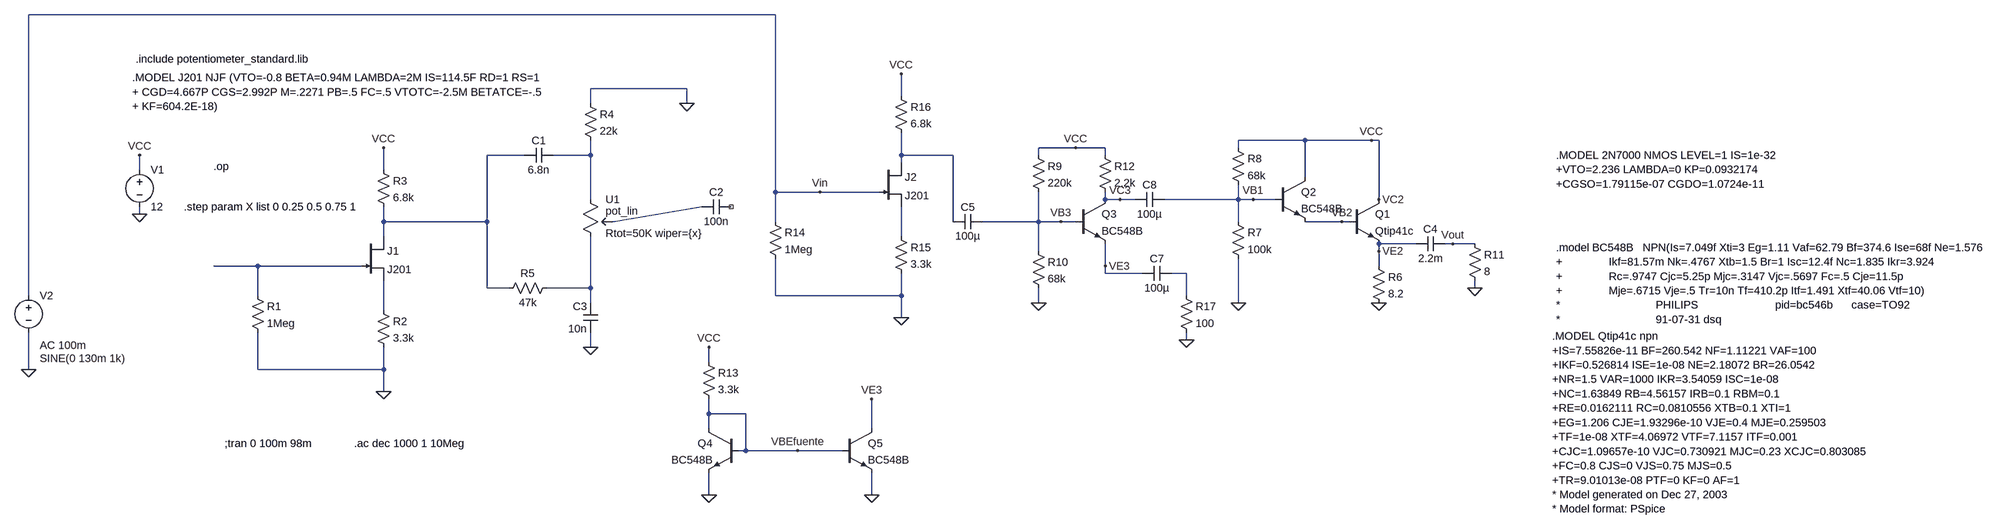
[diagram p0: schematic CircuitoCompletoNuevo.asc]
CircuitoCompletoNuevo.asc, the LTspice schematic file:
Version 4
SHEET 1 5808 1124
WIRE 624 -80 -992 -80
WIRE 432 80 224 80
WIRE 896 96 896 48
WIRE 224 112 224 80
WIRE 432 112 432 80
WIRE 1856 192 1712 192
WIRE 2000 192 1856 192
WIRE 2016 192 2000 192
WIRE 1360 208 1280 208
WIRE 1424 208 1360 208
WIRE 1712 208 1712 192
WIRE 80 224 0 224
WIRE 224 224 224 192
WIRE 224 224 144 224
WIRE 896 224 896 176
WIRE 1008 224 896 224
WIRE 1280 224 1280 208
WIRE 1424 224 1424 208
WIRE 896 240 896 224
WIRE -752 256 -752 224
WIRE -224 256 -224 208
WIRE 1856 272 1856 192
WIRE 624 304 624 -80
WIRE 720 304 624 304
WIRE 848 304 720 304
WIRE 224 320 224 224
WIRE 1424 320 1424 304
WIRE 1456 320 1424 320
WIRE 1488 320 1456 320
WIRE 1712 320 1712 288
WIRE 1712 320 1552 320
WIRE 1744 320 1712 320
WIRE 1792 320 1744 320
WIRE 2016 320 2016 192
WIRE -752 352 -752 336
WIRE -224 368 -224 336
WIRE 0 368 0 224
WIRE 0 368 -224 368
WIRE 272 368 464 336
WIRE 624 368 624 304
WIRE 1008 368 1008 224
WIRE 1280 368 1280 304
WIRE 1280 368 1072 368
WIRE 1328 368 1280 368
WIRE 1360 368 1328 368
WIRE 1712 368 1712 320
WIRE 1936 368 1856 368
WIRE 1952 368 1936 368
WIRE -224 400 -224 368
WIRE 896 400 896 336
WIRE 2096 416 2016 416
WIRE 2176 416 2160 416
WIRE 2224 416 2176 416
WIRE 1280 432 1280 368
WIRE 2016 432 2016 416
WIRE -496 464 -592 464
WIRE -272 464 -496 464
WIRE 1424 464 1424 416
WIRE 2016 464 2016 432
WIRE 1424 480 1424 464
WIRE 1504 480 1424 480
WIRE 1600 480 1568 480
WIRE 0 512 0 368
WIRE 48 512 0 512
WIRE 224 512 224 400
WIRE 224 512 128 512
WIRE 2224 512 2224 496
WIRE -992 528 -992 -80
WIRE -496 528 -496 464
WIRE 624 528 624 448
WIRE 896 528 896 480
WIRE 896 528 624 528
WIRE 1600 528 1600 480
WIRE 224 544 224 512
WIRE 1280 544 1280 512
WIRE 1712 544 1712 448
WIRE -224 560 -224 496
WIRE 896 576 896 528
WIRE 1600 624 1600 608
WIRE 224 640 224 608
WIRE 480 672 480 640
WIRE -992 688 -992 608
WIRE -496 688 -496 608
WIRE -224 688 -224 640
WIRE -224 688 -496 688
WIRE -224 736 -224 688
WIRE 480 784 480 752
WIRE 560 784 480 784
WIRE 480 816 480 784
WIRE 832 816 832 752
WIRE 560 864 560 784
WIRE 560 864 544 864
WIRE 672 864 560 864
WIRE 768 864 672 864
WIRE 480 960 480 912
WIRE 832 960 832 912
FLAG -224 736 0
FLAG -752 352 0
FLAG -752 224 VCC
FLAG -224 208 VCC
FLAG 720 304 Vin
FLAG 224 640 0
FLAG 2000 192 VCC
FLAG 2016 544 0
FLAG 1712 544 0
FLAG 1936 368 VB2
FLAG 1744 320 VB1
FLAG 2016 432 VE2
FLAG 1280 544 0
FLAG 1360 208 VCC
FLAG 1328 368 VB3
FLAG 2224 512 0
FLAG 2016 320 VC2
FLAG 1456 320 VC3
FLAG 1424 464 VE3
FLAG 480 960 0
FLAG 480 640 VCC
FLAG 832 960 0
FLAG 832 752 VE3
FLAG 1600 624 0
FLAG 672 864 VBEfuente
FLAG 2176 416 Vout
FLAG 432 112 0
FLAG 896 576 0
FLAG 896 48 VCC
FLAG -992 688 0
SYMBOL njf -272 400 R0
SYMATTR InstName J1
SYMATTR Value J201
SYMBOL res -512 512 R0
SYMATTR InstName R1
SYMATTR Value 1Meg
SYMBOL res -240 544 R0
SYMATTR InstName R2
SYMATTR Value 3.3k
SYMBOL res -240 240 R0
SYMATTR InstName R3
SYMATTR Value 6.8k
SYMBOL voltage -752 240 R0
SYMATTR InstName V1
SYMATTR Value 12
SYMBOL voltage -992 512 R0
WINDOW 3 24 152 Left 2
WINDOW 123 24 124 Left 2
WINDOW 39 0 0 Left 2
SYMATTR Value SINE(0 130m 1k)
SYMATTR Value2 AC 100m
SYMATTR InstName V2
SYMBOL cap 144 208 R90
WINDOW 0 0 32 VBottom 2
WINDOW 3 32 32 VTop 2
SYMATTR InstName C1
SYMATTR Value 6.8n
SYMBOL cap 240 608 R180
WINDOW 0 24 56 Left 2
WINDOW 3 24 8 Left 2
SYMATTR InstName C3
SYMATTR Value 10n
SYMBOL res 208 96 R0
SYMATTR InstName R4
SYMATTR Value 22k
SYMBOL res 144 496 R90
WINDOW 0 0 56 VBottom 2
WINDOW 3 32 56 VTop 2
SYMATTR InstName R5
SYMATTR Value 47k
SYMBOL potentiometer_standard 208 304 R0
SYMATTR InstName U1
SYMATTR Value Rtot=50K wiper={x}
SYMATTR SpiceLine ""
SYMBOL npn 1952 320 R0
SYMATTR InstName Q1
SYMATTR Value Qtip41c
SYMBOL npn 1792 272 R0
SYMATTR InstName Q2
SYMATTR Value BC548B
SYMBOL res 2000 448 R0
SYMATTR InstName R6
SYMATTR Value 8.2
SYMBOL res 1696 352 R0
SYMATTR InstName R7
SYMATTR Value 100k
SYMBOL res 1696 192 R0
SYMATTR InstName R8
SYMATTR Value 68k
SYMBOL npn 1360 320 R0
SYMATTR InstName Q3
SYMATTR Value BC548B
SYMBOL res 1264 208 R0
SYMATTR InstName R9
SYMATTR Value 220k
SYMBOL res 1264 416 R0
SYMATTR InstName R10
SYMATTR Value 68k
SYMBOL res 2208 400 R0
SYMATTR InstName R11
SYMATTR Value 8
SYMBOL cap 2096 432 R270
WINDOW 0 32 32 VTop 2
WINDOW 3 0 32 VBottom 2
SYMATTR InstName C4
SYMATTR Value 2.2m
SYMBOL res 1408 208 R0
SYMATTR InstName R12
SYMATTR Value 2.2k
SYMBOL npn 544 816 M0
SYMATTR InstName Q4
SYMATTR Value BC548B
SYMBOL res 464 656 R0
SYMATTR InstName R13
SYMATTR Value 3.3k
SYMBOL npn 768 816 R0
SYMATTR InstName Q5
SYMATTR Value BC548B
SYMBOL cap 1504 496 R270
WINDOW 0 32 32 VTop 2
WINDOW 3 0 32 VBottom 2
SYMATTR InstName C7
SYMATTR Value 100µ
SYMBOL res 1584 512 R0
SYMATTR InstName R17
SYMATTR Value 100
SYMBOL cap 1552 304 R90
WINDOW 0 0 32 VBottom 2
WINDOW 3 32 32 VTop 2
SYMATTR InstName C8
SYMATTR Value 100µ
SYMBOL njf 848 240 R0
SYMATTR InstName J2
SYMATTR Value J201
SYMBOL res 608 352 R0
SYMATTR InstName R14
SYMATTR Value 1Meg
SYMBOL res 880 384 R0
SYMATTR InstName R15
SYMATTR Value 3.3k
SYMBOL res 880 80 R0
SYMATTR InstName R16
SYMATTR Value 6.8k
SYMBOL cap 528 320 R90
WINDOW 0 0 32 VBottom 2
WINDOW 3 32 32 VTop 2
SYMATTR InstName C2
SYMATTR Value 100n
SYMBOL cap 1072 352 R90
WINDOW 0 0 32 VBottom 2
WINDOW 3 32 32 VTop 2
SYMATTR InstName C5
SYMATTR Value 100µ
TEXT -768 56 Left 2 !.MODEL J201 NJF (VTO=-0.8 BETA=0.94M LAMBDA=2M IS=114.5F RD=1 RS=1\n+ CGD=4.667P CGS=2.992P M=.2271 PB=.5 FC=.5 VTOTC=-2.5M BETATCE=-.5\n+ KF=604.2E-18)
TEXT -592 248 Left 2 !.op
TEXT -760 16 Left 2 !.include potentiometer_standard.lib
TEXT -656 336 Left 2 !.step param X list 0 0.25 0.5 0.75 1
TEXT 3328 616 Left 2 !.MODEL Qtip41c npn\n+IS=7.55826e-11 BF=260.542 NF=1.11221 VAF=100\n+IKF=0.526814 ISE=1e-08 NE=2.18072 BR=26.0542\n+NR=1.5 VAR=1000 IKR=3.54059 ISC=1e-08\n+NC=1.63849 RB=4.56157 IRB=0.1 RBM=0.1\n+RE=0.0162111 RC=0.0810556 XTB=0.1 XTI=1\n+EG=1.206 CJE=1.93296e-10 VJE=0.4 MJE=0.259503\n+TF=1e-08 XTF=4.06972 VTF=7.1157 ITF=0.001\n+CJC=1.09657e-10 VJC=0.730921 MJC=0.23 XCJC=0.803085\n+FC=0.8 CJS=0 VJS=0.75 MJS=0.5\n+TR=9.01013e-08 PTF=0 KF=0 AF=1\n* Model generated on Dec 27, 2003\n* Model format: PSpice
TEXT 3336 424 Left 2 !.model BC548B   NPN(Is=7.049f Xti=3 Eg=1.11 Vaf=62.79 Bf=374.6 Ise=68f Ne=1.576\n+               Ikf=81.57m Nk=.4767 Xtb=1.5 Br=1 Isc=12.4f Nc=1.835 Ikr=3.924\n+               Rc=.9747 Cjc=5.25p Mjc=.3147 Vjc=.5697 Fc=.5 Cje=11.5p\n+               Mje=.6715 Vje=.5 Tr=10n Tf=410.2p Itf=1.491 Xtf=40.06 Vtf=10)\n*                               PHILIPS                         pid=bc546b      case=TO92\n*                               91-07-31 dsq
TEXT 3336 224 Left 2 !.MODEL 2N7000 NMOS LEVEL=1 IS=1e-32\n+VTO=2.236 LAMBDA=0 KP=0.0932174\n+CGSO=1.79115e-07 CGDO=1.0724e-11
TEXT -568 848 Left 2 !;tran 0 100m 98m
TEXT -288 848 Left 2 !.ac dec 1000 1 10Meg

The netlist it stands for:
* CircuitoCompletoNuevo.asc
J1 N001 N006 N009 J201
R1 N006 0 1Meg
R2 N009 0 3.3k
R3 VC2 N001 6.8k
V1 VC2 0 12
V2 Vin 0 SINE(0 130m 1k) AC 100m
C1 N002 N001 6.8n
C3 0 N008 10n
R4 0 N002 22k
R5 N008 N001 47k
XU1 N002 N008 N004 pot_lin Rtot=50K wiper={x}  ; pins A B C
Q1 VC2 VB2 VE2 0 Qtip41c
Q2 VC2 VB1 VB2 0 BC548B
R6 VE2 0 8.2
R7 VB1 0 100k
R8 VC2 VB1 68k
Q3 VC3 VB3 VE3 0 BC548B
R9 VC2 VB3 220k
R10 VB3 0 68k
R11 Vout 0 8
C4 VE2 Vout 2.2m
R12 VC2 VC3 2.2k
Q4 VBEfuente VBEfuente 0 0 BC548B
R13 VC2 VBEfuente 3.3k
Q5 VE3 VBEfuente 0 0 BC548B
C7 VE3 N007 100µ
R17 N007 0 100
C8 VB1 VC3 100µ
J2 N003 Vin N005 J201
R14 Vin 0 1Meg
R15 N005 0 3.3k
R16 VC2 N003 6.8k
C2 NC_01 N004 100n
C5 VB3 N003 100µ
.model NPN NPN
.model PNP PNP
.lib standard.bjt
.model NJF NJF
.model PJF PJF
.lib standard.jft
.MODEL J201 NJF (VTO=-0.8 BETA=0.94M LAMBDA=2M IS=114.5F RD=1 RS=1
+ CGD=4.667P CGS=2.992P M=.2271 PB=.5 FC=.5 VTOTC=-2.5M BETATCE=-.5
+ KF=604.2E-18)
.op
.include potentiometer_standard.lib
.step param X list 0 0.25 0.5 0.75 1
.MODEL Qtip41c npn
+IS=7.55826e-11 BF=260.542 NF=1.11221 VAF=100
+IKF=0.526814 ISE=1e-08 NE=2.18072 BR=26.0542
+NR=1.5 VAR=1000 IKR=3.54059 ISC=1e-08
+NC=1.63849 RB=4.56157 IRB=0.1 RBM=0.1
+RE=0.0162111 RC=0.0810556 XTB=0.1 XTI=1
+EG=1.206 CJE=1.93296e-10 VJE=0.4 MJE=0.259503
+TF=1e-08 XTF=4.06972 VTF=7.1157 ITF=0.001
+CJC=1.09657e-10 VJC=0.730921 MJC=0.23 XCJC=0.803085
+FC=0.8 CJS=0 VJS=0.75 MJS=0.5
+TR=9.01013e-08 PTF=0 KF=0 AF=1
* Model generated on Dec 27, 2003
* Model format: PSpice
.model BC548B   NPN(Is=7.049f Xti=3 Eg=1.11 Vaf=62.79 Bf=374.6 Ise=68f Ne=1.576
+               Ikf=81.57m Nk=.4767 Xtb=1.5 Br=1 Isc=12.4f Nc=1.835 Ikr=3.924
+               Rc=.9747 Cjc=5.25p Mjc=.3147 Vjc=.5697 Fc=.5 Cje=11.5p
+               Mje=.6715 Vje=.5 Tr=10n Tf=410.2p Itf=1.491 Xtf=40.06 Vtf=10)
*                               PHILIPS                         pid=bc546b      case=TO92
*                               91-07-31 dsq
.MODEL 2N7000 NMOS LEVEL=1 IS=1e-32
+VTO=2.236 LAMBDA=0 KP=0.0932174
+CGSO=1.79115e-07 CGDO=1.0724e-11
;tran 0 100m 98m
.ac dec 1000 1 10Meg
.backanno
.end